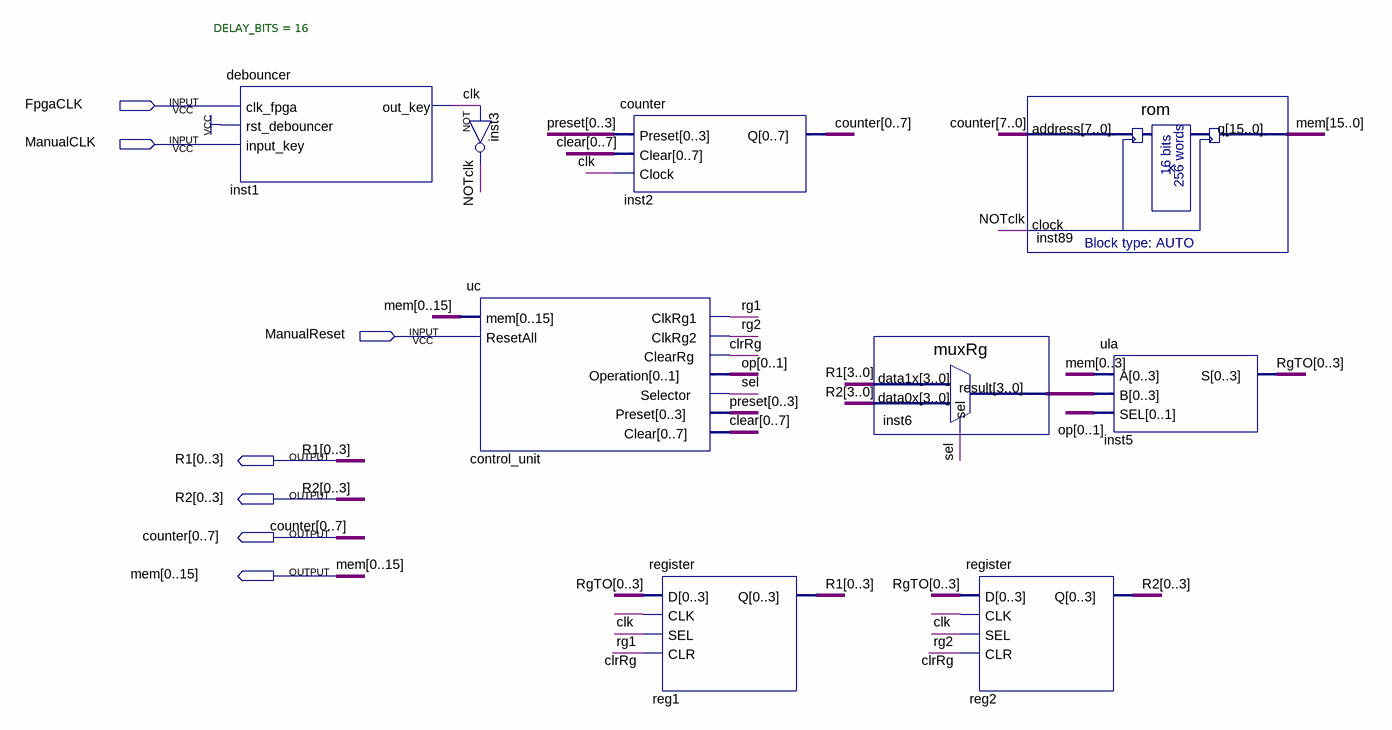
[diagram p0: schematic sheet]
// Quartus schematic cpu.bdf as structural Verilog: 9 symbols, 7 pins
module cpu (
  input  FpgaCLK,
  input  ManualCLK,
  input  ManualReset,
  output [0:3] R1,
  output [0:3] R2,
  output [0:7] counter,
  output [0:15] mem
);

  wire clk, clrRg, NOTclk, rg1, rg2, sel;
  wire [1:0] op;
  wire [3:0] inst6_result, preset, RgTO;
  wire [7:0] clear;

  debouncer #(.DELAY_BITS(16)) inst1 (.clk_fpga(FpgaCLK), .rst_debouncer(1'b1), .input_key(ManualCLK), .out_key(clk));
  not inst3 (NOTclk, clk);
  uc control_unit (
    .mem(mem), .ResetAll(ManualReset), .ClkRg1(rg1), .ClkRg2(rg2), .ClearRg(clrRg),
    .Operation({op[0], op[1]}), .Selector(sel), .Preset({preset[0], preset[1], preset[2], preset[3]}),
    .Clear({clear[0], clear[1], clear[2], clear[3], clear[4], clear[5], clear[6], clear[7]}));
  counter inst2 (
    .Preset({preset[0], preset[1], preset[2], preset[3]}),
    .Clear({clear[0], clear[1], clear[2], clear[3], clear[4], clear[5], clear[6], clear[7]}), .Clock(clk),
    .Q(counter));
  register reg1 (.D({RgTO[0], RgTO[1], RgTO[2], RgTO[3]}), .CLK(clk), .SEL(rg1), .CLR(clrRg), .Q(R1));
  muxRg inst6 (
    .data1x({R1[3], R1[2], R1[1], R1[0]}), .data0x({R2[3], R2[2], R2[1], R2[0]}), .sel(sel),
    .result(inst6_result));
  register reg2 (.D({RgTO[0], RgTO[1], RgTO[2], RgTO[3]}), .CLK(clk), .SEL(rg2), .CLR(clrRg), .Q(R2));
  rom inst89 (
    .address({counter[7], counter[6], counter[5], counter[4], counter[3], counter[2], counter[1], counter[0]}),
    .clock(NOTclk),
    .q({mem[15], mem[14], mem[13], mem[12], mem[11], mem[10], mem[9], mem[8], mem[7], mem[6], mem[5], mem[4], mem[3], mem[2], mem[1], mem[0]}));
  ula inst5 (.A(mem[0:3]), .B(inst6_result), .SEL({op[0], op[1]}), .S({RgTO[0], RgTO[1], RgTO[2], RgTO[3]}));
endmodule
